# EAGLE design usb-board (EAGLE 9.6.2)
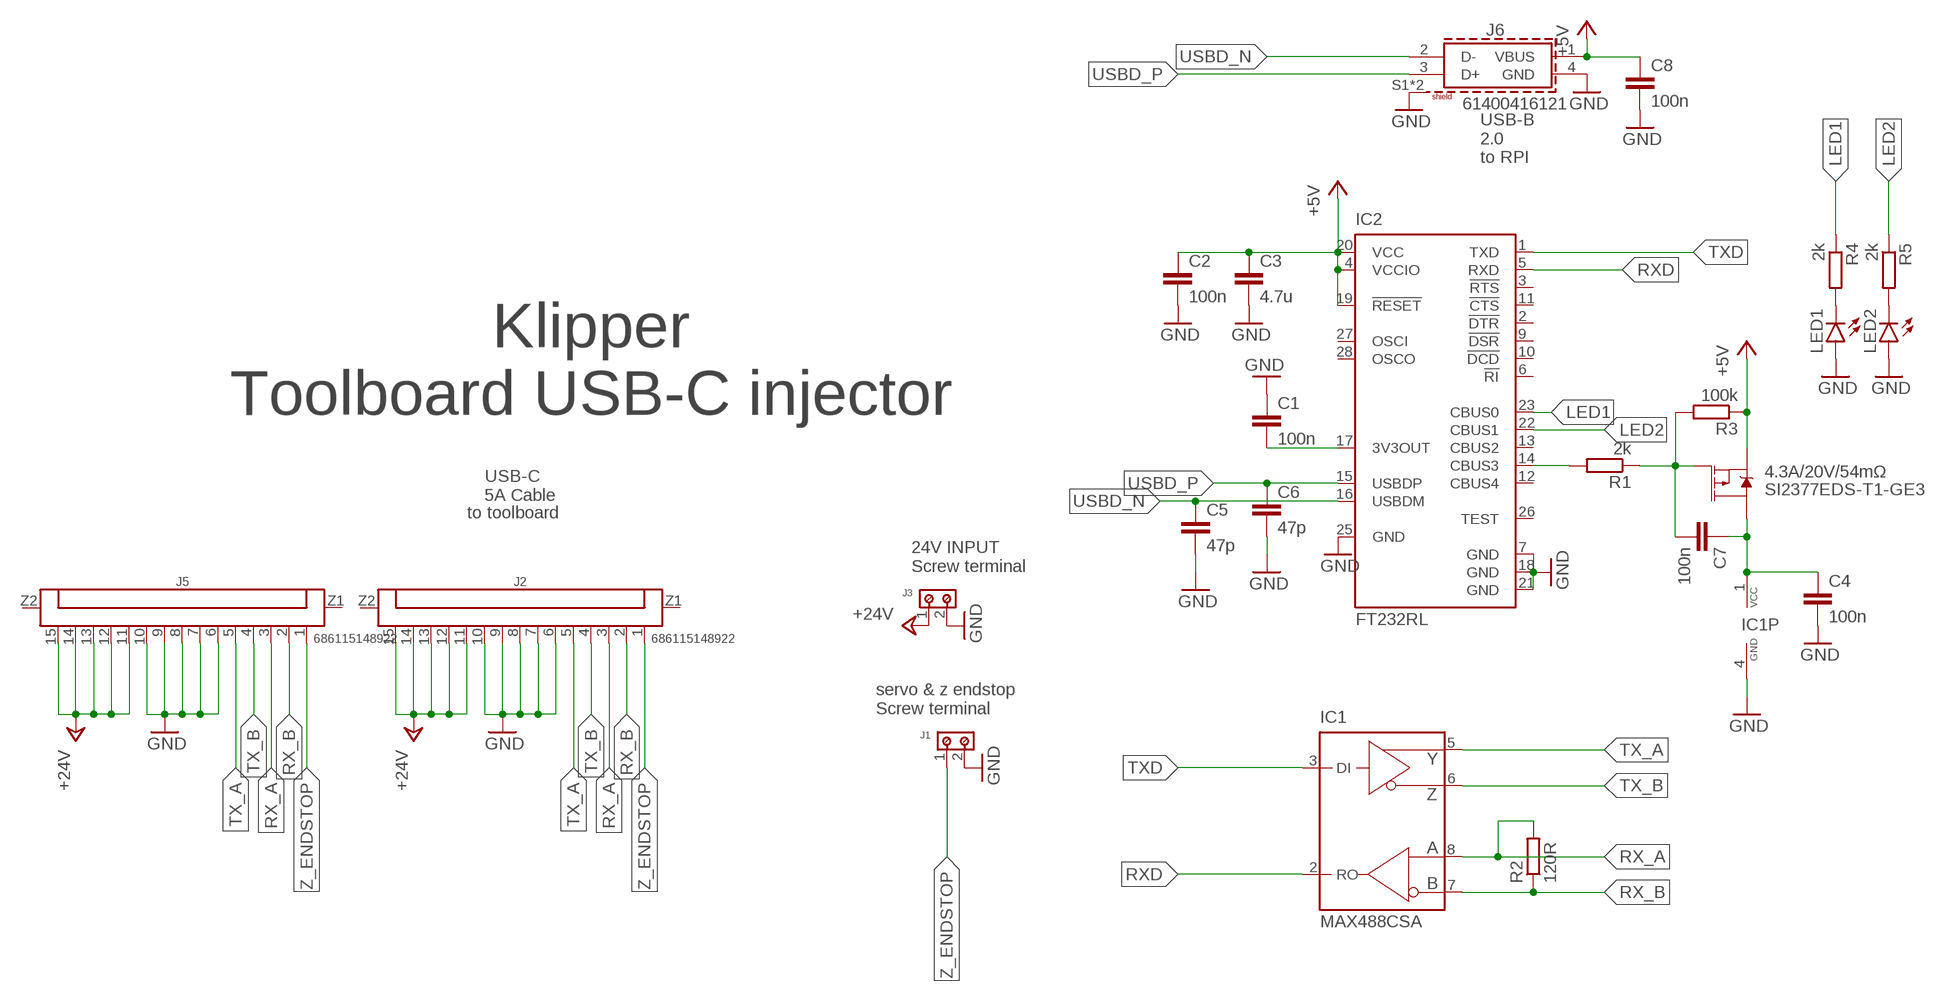
[diagram p0: schematic, sheet 1]

## Parts
C1  100n  C-EUC0805  [C0805]
C2  100n  C-EUC0805  [C0805]
C3  4.7u  C-EUC0805  [C0805]
C4  100n  C-EUC0805  [C0805]
C5  47p  C-EUC0805  [C0805]
C6  47p  C-EUC0805  [C0805]
C7  100n  C-EUC0805  [C0805]
C8  100n  C-EUC0805  [C0805]
IC1  MAX488CSA  [SO08]
IC2  FT232RL  [SSOP28]
J1  691103110002  [691103110002]
J2  686115148922  6861XX148922_686115148922  [686115148922]
J3  691103110002  [691103110002]
J5  686115148922  6861XX148922_686115148922  [686115148922]
J6  61400416121  [61400416121]
LED1  LEDCHIPLED_0805  [CHIPLED_0805]
LED2  LEDCHIPLED_0805  [CHIPLED_0805]
R1  2k  R-EU_R0805  [R0805]
R2  120R  R-EU_R0805  [R0805]
R3  100k  R-EU_R0805  [R0805]
R4  2k  R-EU_R0805  [R0805]
R5  2k  R-EU_R0805  [R0805]
SI2377EDS-T1-GE3  4.3A/20V/54mΩ  MOSFET_PCH-IRLML2244  [SOT23-3]

## Nets
+5V: C2.1 C3.1 C8.1 IC2.4(VCCIO) IC2.19(!RESET) IC2.20(VCC) J6.1(VBUS) R3.1 SI2377EDS-T1-GE3.2(S)
+24V: J2.11 J2.12 J2.13 J2.14 J2.15 J3.1 J5.11 J5.12 J5.13 J5.14 J5.15
GND: C1.1 C2.2 C3.2 C4.2 C5.2 C6.2 C8.2 IC1.4(GND) IC2.7(GND) IC2.18(GND) IC2.21(GND) IC2.25(GND) J1.2 J2.6 J2.7 J2.8 J2.9 J2.10 J3.2 J5.6 J5.7 J5.8 J5.9 J5.10 J6.4(GND) J6.S1(SHIELD) J6.S2(SHIELD) LED1.A LED2.A
LED1: IC2.23(CBUS0) R4.1
LED2: IC2.22(CBUS1) R5.1
N$1: C1.2 IC2.17(3V3OUT)
N$2: IC2.14(CBUS3) R1.2
N$3: C7.2 R1.1 R3.2 SI2377EDS-T1-GE3.1(G)
N$4: C4.1 C7.1 IC1.1(VCC) SI2377EDS-T1-GE3.3(D)
N$5: LED1.C R4.2
N$6: LED2.C R5.2
RX_A: IC1.8(A) J2.3 J5.3 R2.2
RX_B: IC1.7(B) J2.2 J5.2 R2.1
RXD: IC1.2(RO) IC2.5(RXD)
TX_A: IC1.5(Y) J2.5 J5.5
TX_B: IC1.6(Z) J2.4 J5.4
TXD: IC1.3(DI) IC2.1(TXD)
USBD_N [usb]: C5.1 IC2.16(USBDM) J6.2(D-)
USBD_P [usb]: C6.1 IC2.15(USBDP) J6.3(D+)
Z_ENDSTOP: J1.1 J2.1 J5.1
Unconnected: IC2.2(!DTR) IC2.3(!RTS) IC2.6(!RI) IC2.9(!DSR) IC2.10(!DCD) IC2.11(!CTS) IC2.12(CBUS4) IC2.13(CBUS2) IC2.26(TEST) IC2.27(OSCI) IC2.28(OSCO) J2.Z1 J2.Z2 J5.Z1 J5.Z2

## Notes on the sheet
- USB-B
  2.0
  to RPI
- Klipper
  Toolboard USB-C injector
- USB-C
  5A Cable
- to toolboard
- 24V INPUT
  Screw terminal
- servo & z endstop
  Screw terminal

## Library data of the parts
C1-C8 = rcl:C-EU: CAPACITOR, European symbol; SPICEPREFIX: C
IC1 = maxim:MAX488: RS485 TRANSEIVER Source: Data sheet <http://datasheets.maxim-ic.com/en/ds/MAX1487-MAX491.pdf>; MF: MAXIM; MPN: MAX488CSA; OC_FARNELL: 3534170; OC_NEWARK: 34C3921
IC2 = ftdichip:FT232R: Source: http://www.ftdichip.com/Documents/DataSheets/DS_FT232R_v104.pdf; MPN: FT232RL; OC_FARNELL: 1146032; OC_NEWARK: 91K9918
J1 J3 = Eagle_WR-TBL Wire Protector (rev20a):691103110002: WR-TBL Serie 1031 - 3.50 mm Horiz. Entry Modular KIND PROPERTIES Pitch 3.5 mm MATERIAL PROPERTIES Insulator Material PA66 Insulator Flammability Rating UL94 V-0 Insulator Color Blue Contact Material Brass Contact Plating Copper over Zinc Terminal Screw Material Steel Terminal Screw Plating Zinc Wire Guard Material Stainless Steel GENERAL INFORMATION Operating Temperature -40 up to +105 °C Compliance Lead free / RoHS ELECTRICAL PROPERTIES IR UL 10 A Working Voltage [UL] 125 V (AC) Withstanding Voltage [UL] 1250 V (AC) Contact Resistance 20 mΩ Contact Resistance [UL] 20 mΩ MECHANICAL PROPERTIES Wire Strip Length 5 up to 6 (mm) Screw M2 Solid Wire Section (AWG) 26 to 16 (AWG) Solid Wire Section (Metric) 0.129 to 1.31 (mm²) Stranded Wire Section (AWG) 26 to 16 (AWG) Stranded Wire Section (Metric) 0.129 to 1.31 (mm²) CERTIFICATION UL Approval E315414 PACKAGING PROPERTIES Packaging Box <https://katalog.we-online.com/media/images/v2/o33226v209%20Family_WR-TBL_69110311000x.jpg> Details see: https://katalog.we-online.com/en/em/TBL_3_50_1031_6911031100XX Updated by Ella Wu 2019-11-07 2019(C) Wurth Elektronik; DATASHEET-URL: https://www.we-online.com/catalog/datasheet/691103110002.pdf; IR-UL: 10A; MOUNT: THT; PART-NUMBER: 691103110002; PINS: 2; PITCH: 3.5mm; TYPE: Horizontal; WIRE: 26 to 16 (AWG) 0.129 to 1.31 (mm²); WORKING-VOLTAGE-UL: 125V(AC)
J2 J5 = Eagle_WR-FPC (rev21a):6861XX148922_686115148922: WR-FPC 1.00 mm SMT ZIF Horizontal - Bottom Contact - Hinge Type KIND PROPERTIES Pitch 1 mm MATERIAL PROPERTIES Insulator Material PA6T Contact Material Phosphor Bronze Contact Plating 120 (µ") Tin over 50 (µ") Nickel Contact Type Stamped Solder Tabs Brass <https://www.we-online.com/catalog/media/o58875v209%20Family_Con_FPC_ZIF_100_6861xx148922.jpg> Details see: https://www.we-online.com/catalog/en/FPC_1_00_SMT_ZIF_HORIZONTAL_BOTTOM_CONTACT_HINGE_TYPE_6861XX148922/ Updated by Ella Wu 2020-08-26 2020(C) Wurth Elektronik; CONTACT-RESISTANCE: 50Ohm; DATASHEET-URL: https://www.we-online.com/catalog/datasheet/686115148922.pdf; IR: 1A; L: 19.6mm; MATE-WITH: WR-FFC 1.00 mm Flat Flexible Cable Type 1 (Contacts on same side)/ Type 2 (Contacts opposite); PACKAGING: Tape and Reel; PART-NUMBER: 686115148922; PINS: 15; PITCH: 1mm; TYPE: Horizontal; WORKING-VOLTAGE: 100V(AC)
J6 = Eagle_WR-USB (rev21d):61400416121: WR-COM USB 2.0 Horizontal THT Kind Properties Durability:1500 Mating cycles Quality Class:1 500 Mating cycles Connector Type:USB Gender:Female Type:Horizontal General Information Operating Temperature:-40up to +105 °C Compliance:RoHS Electrical Properties IR 1:1.5 A Working Voltage:30V (AC) Withstanding Voltage:750V (AC) Contact Resistance:20 mΩ Material Properties Insulator Material:PBT Insulator Flammability Rating:UL94 V-0 Color:White Cover Material:Brass Cover Plating:Nickel Contact Material:Copper Alloy Contact Plating:Selective Gold Contact Type:Stamped Shielding Material:Brass Shielding Plating:Nickel <https://www.we-online.com/catalog/media/o32985v209%20Family_WR-COM_61400416121.jpg> Details see: https://www.we-online.com/catalog/en/COM_TYPE_B_HORIZONTAL/ Updated by Yingchun, Shan 2020-01-16 2020 (C) Würth Elektronik; APPLICATION: USB 2.0; DATASHEET-URL: https://www.we-online.com/catalog/datasheet/61400416121.pdf; GERDER: Female; INTERFACE-TYPE: Type B; IR1: 1.5A; MOUNT: THT; PACKAGING: Tray; PART-NUMBER: 61400416121; PINS: 4; TYPE: Horizontal; WORKING-VOLTAGE: 30V(AC)
LED1 LED2 = led:LED: LED OSRAM: - CHIPLED LG R971, LG N971, LY N971, LG Q971, LY Q971, LO R971, LY R971 LH N974, LH R974 LS Q976, LO Q976, LY Q976 LO Q996 - Hyper CHIPLED LW Q18S LB Q993, LB Q99A, LB R99A - SideLED LS A670, LO A670, LY A670, LG A670, LP A670 LB A673, LV A673, LT A673, LW A673 LH A674 LY A675 LS A676, LA A676, LO A676, LY A676, LW A676 LS A679, LY A679, LG A679 - Hyper Micro SIDELED® LS Y876, LA Y876, LO Y876, LY Y876 LT Y87S - SmartLED LW L88C, LW L88S LB L89C, LB L89S, LG L890 LS L89K, LO L89K, LY L89K LS L896, LA L896, LO L896, LY L896 - TOPLED LS T670, LO T670, LY T670, LG T670, LP T670 LSG T670, LSP T670, LSY T670, LOP T670, LYG T670 LG T671, LOG T671, LSG T671 LB T673, LV T673, LT T673, LW T673 LH T674 LS T676, LA T676, LO T676, LY T676, LB T676, LH T676, LSB T676, LW T676 LB T67C, LV T67C, LT T67C, LS T67K, LO T67K, LY T67K, LW E67C LS E67B, LA E67B, LO E67B, LY E67B, LB E67C, LV E67C, LT E67C LW T67C LS T679, LY T679, LG T679 LS T770, LO T770, LY T770, LG T770, LP T770 LB T773, LV T773, LT T773, LW T773 LH T774 LS E675, LA E675, LY E675, LS T675 LS T776, LA T776, LO T776, LY T776, LB T776 LHGB T686 LT T68C, LB T68C - Hyper Mini TOPLED® LB M676 - Mini TOPLED Santana® LG M470 LS M47K, LO M47K, LY M47K Source: http://www.osram.convergy.de LUXEON: - LUMILED® LXK2-PW12-R00, LXK2-PW12-S00, LXK2-PW14-U00, LXK2-PW14-V00 LXK2-PM12-R00, LXK2-PM12-S00, LXK2-PM14-U00 LXK2-PE12-Q00, LXK2-PE12-R00, LXK2-PE12-S00, LXK2-PE14-T00, LXK2-PE14-U00 LXK2-PB12-K00, LXK2-PB12-L00, LXK2-PB12-M00, LXK2-PB14-N00, LXK2-PB14-P00, LXK2-PB14-Q00 LXK2-PR12-L00, LXK2-PR12-M00, LXK2-PR14-Q00, LXK2-PR14-R00 LXK2-PD12-Q00, LXK2-PD12-R00, LXK2-PD12-S00 LXK2-PH12-R00, LXK2-PH12-S00 LXK2-PL12-P00, LXK2-PL12-Q00, LXK2-PL12-R00 Source: www.luxeon.com KINGBRIGHT: KA-3528ASYC Source: www.kingbright.com
R1-R5 = rcl:R-EU_: RESISTOR, European symbol; SPICEPREFIX: R
SI2377EDS-T1-GE3 = SparkFun-DiscreteSemi:MOSFET_PCH: P-channel MOSFETs Voltage controlled devices that allow control of high current outputs. SparkFun Products: SparkFun ESP32 Thing <https://www.sparkfun.com/products/13907> SparkFun ESP8266 Thing <https://www.sparkfun.com/products/13231>; PROD_ID: TRANS-11153

## Board
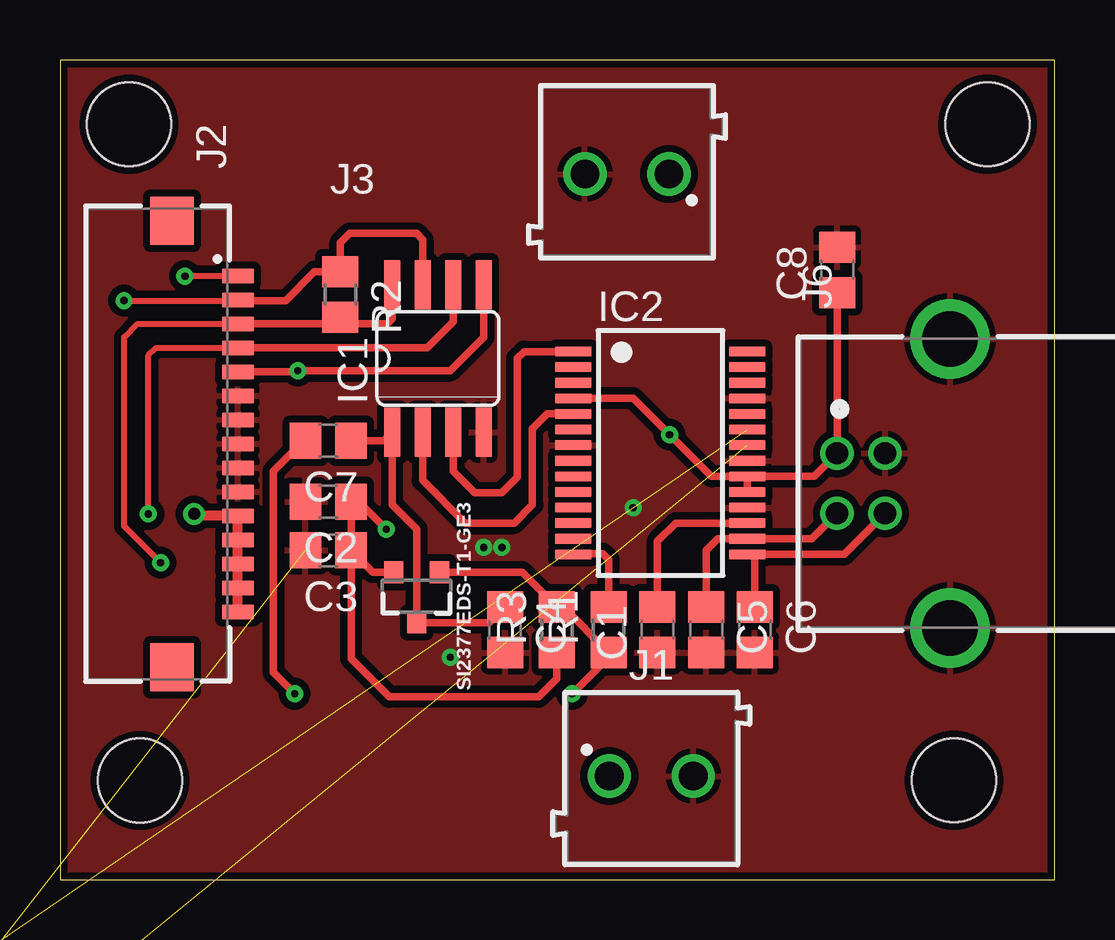
[diagram p1: board, top side]
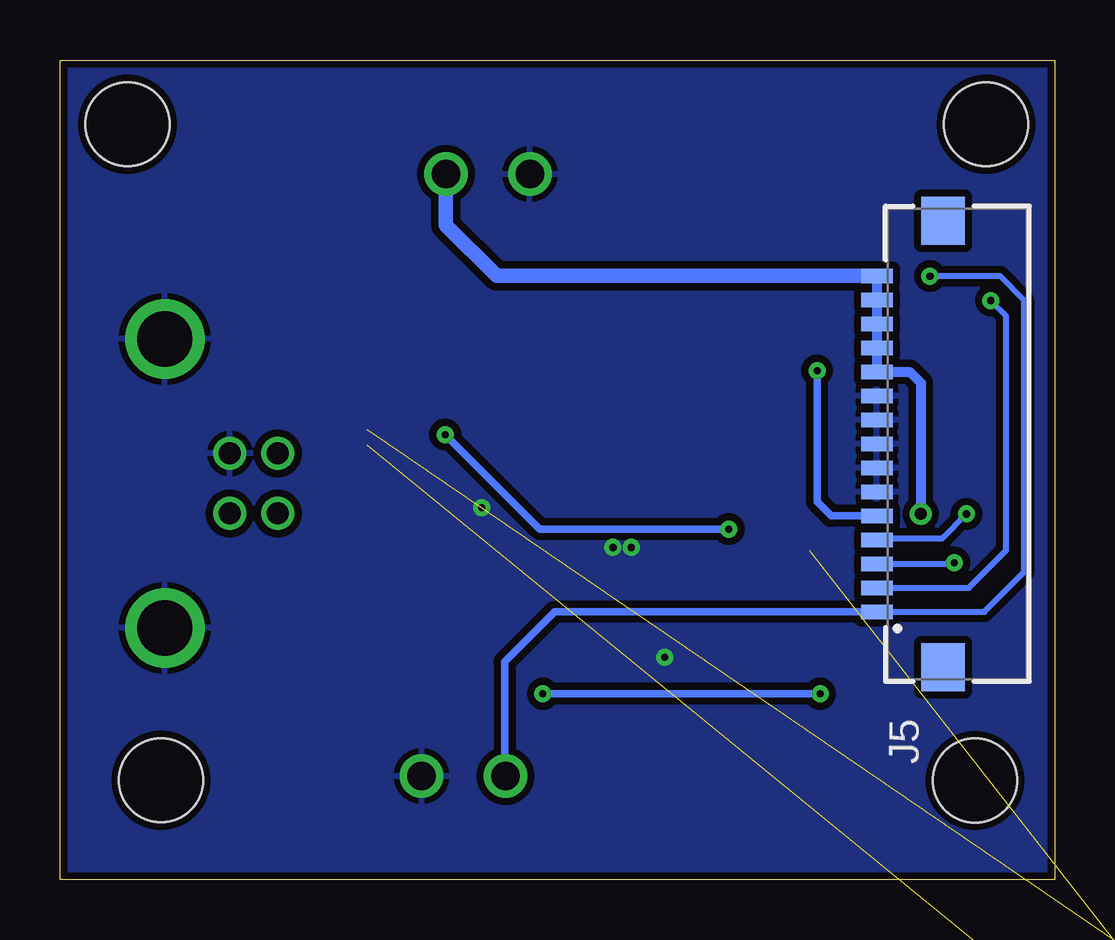
[diagram p2: board, bottom side, seen from below]

Size 41.45 x 34.15 mm. Coordinates in mm from the lower left corner, seen from the top.
Outline: 0,0 41.45,0 41.45,34.15 0,34.15 0,0
Copper layers (1*16): Top 0.018mm / dielectric 1.5mm / Bottom 0.018mm
Design rules "default *": minimum track width 0.15mm, minimum drill 0.3mm, track to track 0.15mm, track to pad 0.15mm, pad to pad 0.15mm, via to via 0.15mm, smd to smd 0.15mm, copper to edge 0.2mm, drill to drill 6mil, minimum pad ring 4mil, minimum via ring 8mil, stop-mask expansion 4mil, vias tented up to drill 0mil, thermal gap 10mil
Holes 3.5 mm at 3.33,4.13 2.87,31.48 38.64,31.48 37.24,4.14

### Footprints (pad centres in the part's own frame; a part is rotated, then mirrored left to right if it is on the bottom)
C0805 = smd 1.3 x 1.5: 1 -0.95,0; 2 0.95,0
SO08 = smd 0.66 x 2.032: 1 -1.905,-3.073; 2 -0.635,-3.073; 3 0.635,-3.073; 4 1.905,-3.073; 5 1.905,3.073; 6 0.635,3.073; 7 -0.635,3.073; 8 -1.905,3.073
SSOP28 = smd 0.4 x 1.5: 1 -4.225,-3.625; 2 -3.575,-3.625; 3 -2.925,-3.625; 4 -2.275,-3.625; 5 -1.625,-3.625; 6 -0.975,-3.625; 7 -0.325,-3.625; 8 0.325,-3.625; 9 0.975,-3.625; 10 1.625,-3.625; 11 2.275,-3.625; 12 2.925,-3.625; 13 3.575,-3.625; 14 4.225,-3.625; 15 4.225,3.625; 16 3.575,3.625; 17 2.925,3.625; 18 2.275,3.625; 19 1.625,3.625; 20 0.975,3.625; 21 0.325,3.625; 22 -0.325,3.625; 23 -0.975,3.625; 24 -1.625,3.625; 25 -2.275,3.625; 26 -2.925,3.625; 27 -3.575,3.625; 28 -4.225,3.625
691103110002 = drill 1.2: 1 -1.75,0; 2 1.75,0
686115148922 = smd 0.6 x 1.3: 1 -7,3.35; 2 -6,3.35; 3 -5,3.35; 4 -4,3.35; 5 -3,3.35; 6 -2,3.35; 7 -1,3.35; 8 0,3.35; 9 1,3.35; 10 2,3.35; 11 3,3.35; 12 4,3.35; 13 5,3.35; 14 6,3.35; 15 7,3.35 | smd 2 x 1.8: Z1 -9.3,0.6; Z2 9.3,0.6
61400416121 = drill 0.92: 1 1.25,6.74; 2 -1.25,6.74; 3 -1.25,4.74; 4 1.25,4.74 | drill 2.3: S1 -6.02,2.03; S2 6.02,2.03
CHIPLED_0805 = smd 1.2 x 1.2: A 0,-1.05; C 0,1.05
R0805 = smd 1.3 x 1.5: 1 -0.95,0; 2 0.95,0
SOT23-3 = smd 0.8 x 0.9: 1 -0.95,-1; 2 0.95,-1; 3 0,1.1

### Placement (x,y rotation side)
C1  24.89,10.41 90 top
C2  11.18,15.75 180 top
C3  11.18,13.72 180 top
C4  18.54,10.41 270 top
C5  26.92,10.41 270 top
C6  28.96,10.41 270 top
C7  11.18,18.29 180 top
C8  32.38,25.4 90 top
IC1  15.75,21.72 0 top
IC2  25.02,17.78 270 top
J1  24.64,4.32 0 top
J2  4.06,18.16 270 top
J3  23.62,29.4 180 top
J5  4.06,18.16 90 bottom
J6  39.12,16.51 90 top
LED1  -5.08,-4.83 0 top  (outside the outline)
LED2  -11.3,-4.83 0 top  (outside the outline)
R1  22.86,10.41 90 top
R2  11.68,24.38 270 top
R3  20.7,10.41 90 top
R4  -12.32,-9.91 0 top  (outside the outline)
R5  -12.32,-16.13 0 top  (outside the outline)
SI2377EDS-T1-GE3  14.86,11.81 180 top

### Tracks (layer width: path | path; a pad name or v marks a point on that pad's centre or on a via)
+5V  (via drill 0.3)
  Top 0.305: IC2.20 31.42,16.8 32.2,17.58 | 32.2,17.58 J6.1 | IC2.19 IC2.20 | IC2.20 27.14,16.8 25.46,18.48 | 25.46,18.48 23.88,20.07 21.41,20.07 IC2.4 | C8.1 J6.1 32.2,17.58 | SI2377EDS-T1-GE3.2 13.03,12.81 C3.1 | C3.1 C2.1 12.45,15.75 v13.59,14.6 | R3.1 20.7,8.38 19.94,7.62 13.72,7.62 12.13,9.21 C3.1 | v25.4,18.54 25.46,18.48
  Bottom 0.305: v13.59,14.6 21.46,14.6 v25.4,18.54
+24V  (via drill 0.5)
  Top 0.406: J2.15 J2.14 J2.13 J2.12 J2.11 5.67,15.16 v5.59,15.24
  Bottom 0.406: J5.15 J5.14 J5.13 J5.12 J5.11 6.05,21.16 5.59,20.7 v5.59,15.24
  Bottom 0.61: J5.15 23.26,25.16 25.37,27.28 J3.1
GND  (via drill 0.3)  (2 unrouted)
  other vias: 23.88,15.49 16.26,9.27 18.41,13.84 17.65,13.84
  pour Top (isolate 0.305): -1.91,36.58 54.61,36.58 54.61,0.25 53.98,-0.38 -1.27,-0.38 -1.91,0.25
  pour Bottom (isolate 0.305): -1.27,36.32 55.24,36.32 55.24,-1.02 -1.27,-1.02
LED1  (1 unrouted)
LED2  (1 unrouted)
N$1
  Top 0.305: IC2.17 25.65,14.85 24.89,14.1 C1.2
N$2
  Top 0.305: R1.2 22.86,13.33 22.61,13.59 21.43,13.59 IC2.14
N$3  (via drill 0.3)
  Top 0.305: SI2377EDS-T1-GE3.1 19.25,12.81 R3.2 20.96,11.36 R1.1 22.86,9.27 v21.34,7.75 | C7.2 10.16,18.29 8.89,17.02 8.89,8.64 v9.78,7.75
  Bottom 0.305: v9.78,7.75 v21.34,7.75
N$4
  Top 0.305: C7.1 13.49,18.29 IC1.1 13.84,15.62 14.86,14.6 SI2377EDS-T1-GE3.3 17.89,10.71 C4.1
N$5  (1 unrouted)
N$6  (1 unrouted)
RX_A  (via drill 0.3)
  Top 0.254: v4.19,13.21 2.67,14.73 2.67,22.61 3.22,23.16 J2.3
  Top 0.305: J2.3 11.68,23.16 | 11.68,23.16 13.64,23.16 13.84,23.37 IC1.8 | R2.2 11.68,23.16
  Bottom 0.254: J5.3 4.24,13.16 v4.19,13.21
RX_B  (via drill 0.3)
  Top 0.254: v2.67,24.13 7.38,24.13 J2.2
  Top 0.305: 7.38,24.13 9.4,24.13 10.6,25.33 R2.1 11.68,26.54 12.06,26.92 14.86,26.92 15.11,26.67 IC1.7
  Bottom 0.254: J5.2 3.59,12.16 2.03,13.72 2.03,23.5 v2.67,24.13
RXD
  Top 0.305: IC1.2 15.11,16.64 16.89,14.86 18.92,14.86 19.68,15.62 19.68,18.8 20.29,19.4 IC2.5
TX_A  (via drill 0.3)
  Top 0.305: J2.5 9.86,21.16 v9.91,21.21 16.26,21.21 17.65,22.61 IC1.5
  Bottom 0.305: J5.5 9.32,15.16 9.91,15.75 v9.91,21.21
TX_B  (via drill 0.3)
  Top 0.254: v3.68,15.24 3.68,21.84 4,22.16 J2.4
  Top 0.305: J2.4 15.3,22.16 16.38,23.24 IC1.6
  Bottom 0.254: J5.4 7.35,14.22 4.7,14.22 v3.68,15.24
TXD
  Top 0.305: IC1.3 16.38,17.02 17.27,16.13 18.41,16.13 19.05,16.76 19.05,21.72 19.34,22 IC2.1
USBD_N
  Top 0.305: J6.2 31.32,14.21 IC2.16 27.41,14.21 26.92,13.72 C5.1
USBD_P
  Top 0.305: IC2.15 28.96,13.55 | 28.96,13.55 32.67,13.55 J6.3 | C6.1 28.96,13.55
Z_ENDSTOP  (via drill 0.3)
  Top 0.254: v5.21,25.15 5.22,25.16 J2.1
  Bottom 0.254: J5.1 2.94,11.16 1.27,12.83 1.27,24.13 2.29,25.15 v5.21,25.15
  Bottom 0.305: J5.1 20.84,11.16 22.92,9.08 22.92,4.35 J1.1